# Altium project PROTO_QTOUCH.PrjPcb
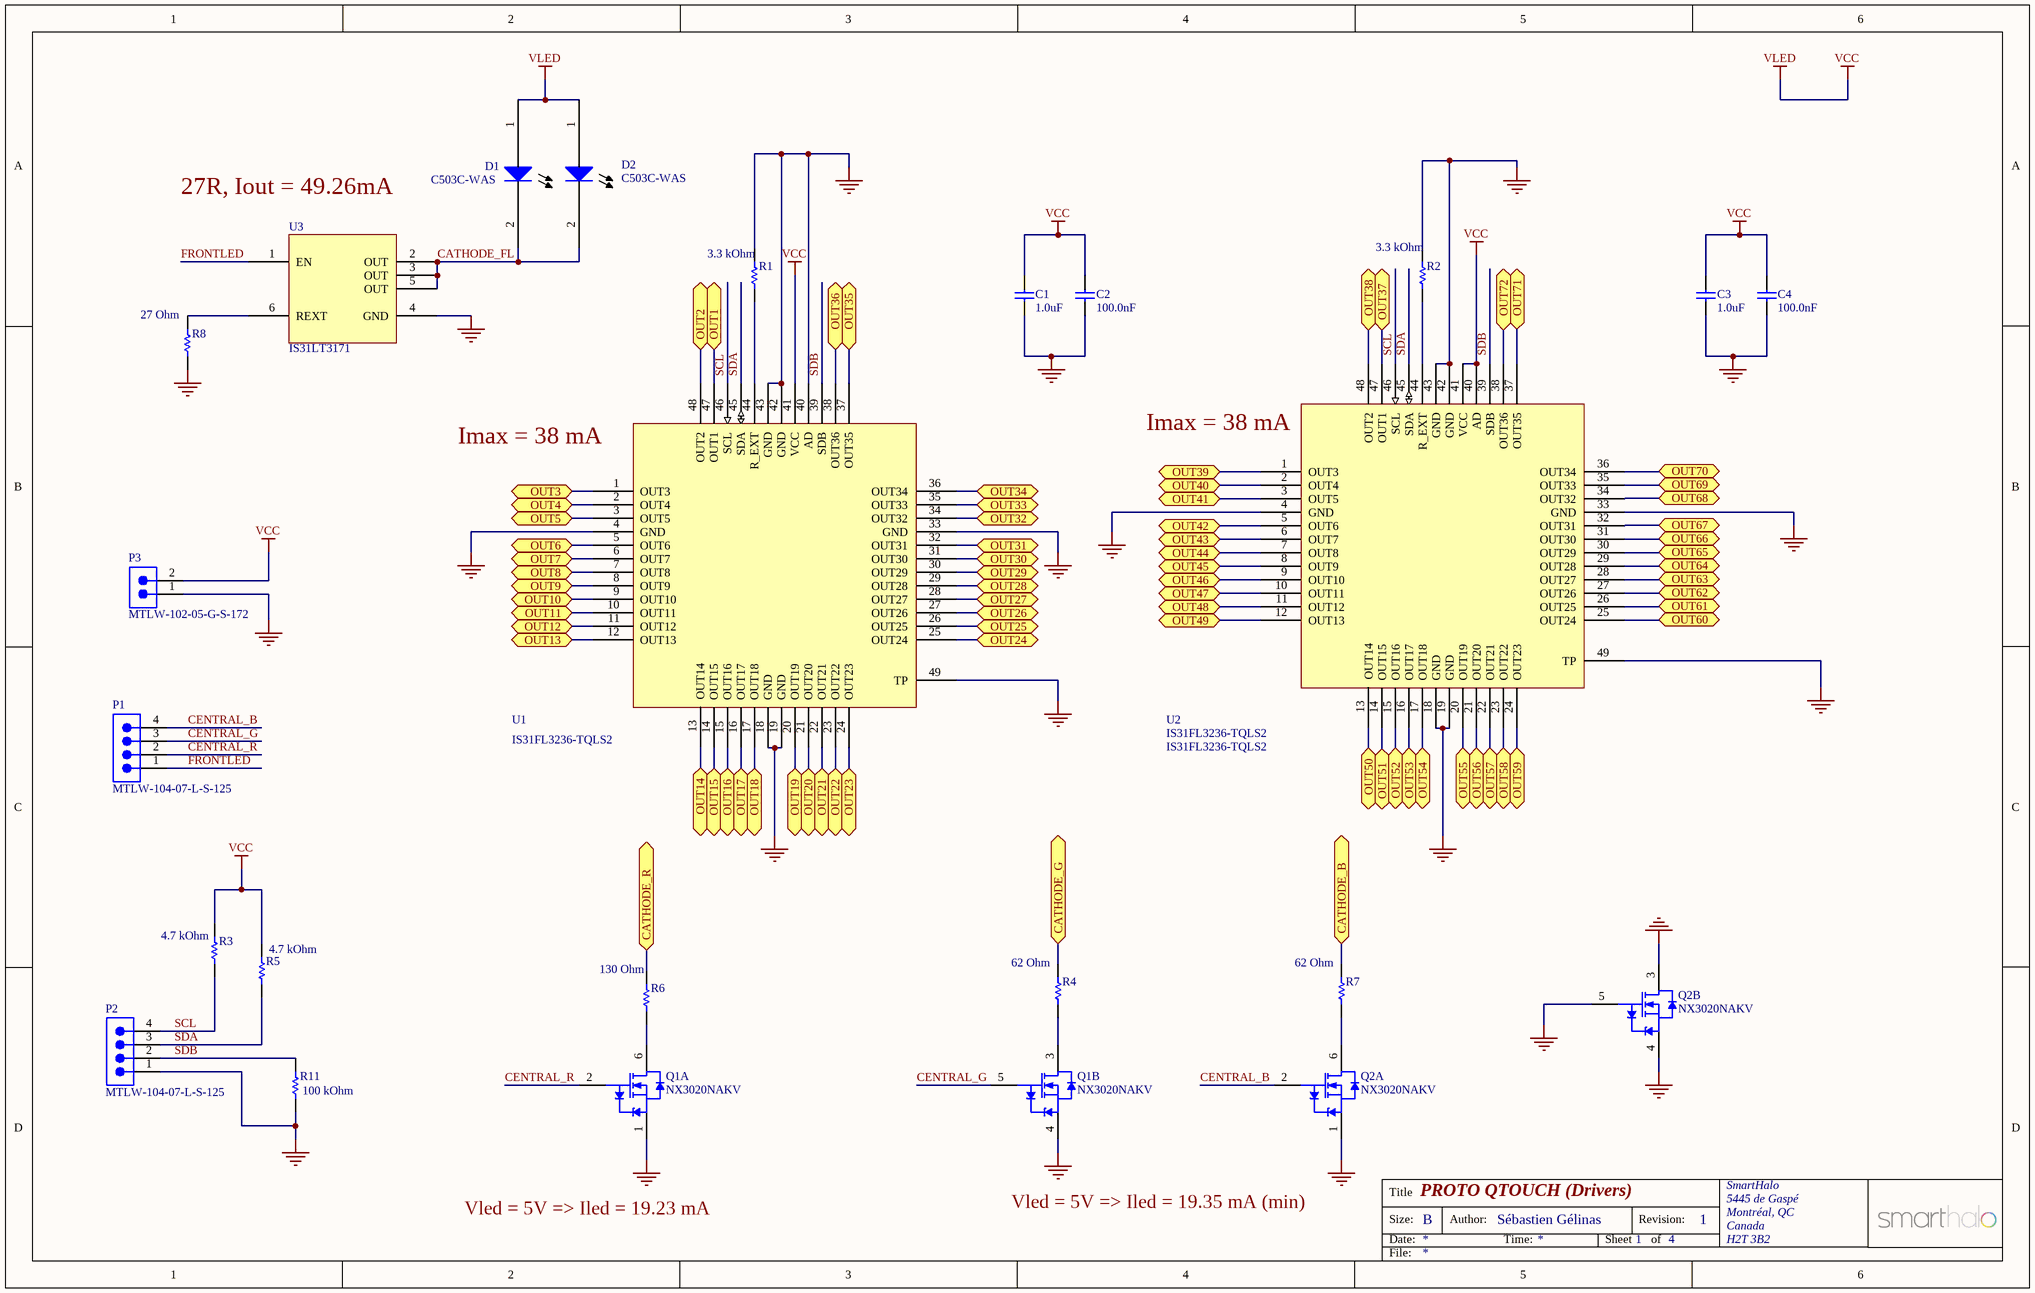
[diagram p0: DRIVERS_CONNECTORS.SchDoc]
4 sheets, 61 parts. Net scope: flat (ports and power ports of the same name join across sheets).
Board file: PROTO_QTOUCH.PcbDoc
Sheets:
  DRIVERS_CONNECTORS.SchDoc
  LEDS.SchDoc
  CENTRALLEDS.SchDoc
  TOUCH.SchDoc

## Sheet DRIVERS_CONNECTORS.SchDoc: PROTO QTOUCH (Drivers)
size B; Author: Sébastien Gélinas; Organization: SmartHalo; Address1: 5445 de Gaspé; Address2: Montréal, QC; Address3: Canada; Address4: H2T 3B2; Revision: 1; SheetNumber: 1; SheetTotal: 4

### Parts
C1  1.0uF  [CAPC0603(1608)100_N]
C2  100.0nF  [CAPC0603(1608)100_N]
C3  1.0uF  [CAPC0603(1608)100_N]
C4  100.0nF  [CAPC0603(1608)100_N]
D1  C503C-WAS  [FRONTLED_PADS]
D2  C503C-WAS  [FRONTLED_PADS]
P1  MTLW-104-07-L-S-125  [SMTC-MTLW-104-07-X-S-125]  (no BOM)
P2  MTLW-104-07-L-S-125  [SMTC-MTLW-104-07-X-S-125]  (no BOM)
P3  MTLW-102-05-G-S-172  [SMTC-MTLW-102-05-X-S-172]  (no BOM)
Q1  NX3020NAKV  [SOT666]  (parts A,B of 2)
Q2  NX3020NAKV  [SOT666]  (parts A,B of 2)
R1  3.3 kOhm  [RESC0603(1608)_M]
R2  3.3 kOhm  [RESC0603(1608)_M]
R3  4.7 kOhm  [RESC0603(1608)_M]
R4  62 Ohm  [RESC0603(1608)_M]
R5  4.7 kOhm  [RESC0603(1608)_M]
R6  130 Ohm  [RESC0603(1608)_M]
R7  62 Ohm  [RESC0603(1608)_M]
R8  27 Ohm  [RESC0603(1608)_M]
R11  100 kOhm  [RESC0603(1608)_M]
U1  IS31FL3236-TQLS2  [TQFP48]
U2  IS31FL3236-TQLS2  [TQFP48]
U3  IS31LT3171  [SOT23-6]

### Ports
CATHODE_B, CATHODE_G, CATHODE_R, OUT1, OUT2, OUT3, OUT4, OUT5, OUT6, OUT7, OUT8, OUT9, OUT10, OUT11, OUT12, OUT13, OUT14, OUT15, OUT16, OUT17, OUT18, OUT19, OUT20, OUT21, OUT22, OUT23, OUT24, OUT25, OUT26, OUT27, OUT28, OUT29, OUT30, OUT31, OUT32, OUT33, OUT34, OUT35, OUT36, OUT37, OUT38, OUT39, OUT40, OUT41, OUT42, OUT43, OUT44, OUT45, OUT46, OUT47, OUT48, OUT49, OUT50, OUT51, OUT52, OUT53, OUT54, OUT55, OUT56, OUT57, OUT58, OUT59, OUT60, OUT61, OUT62, OUT63, OUT64, OUT65, OUT66, OUT67, OUT68, OUT69, OUT70, OUT71, OUT72

### Nets
GND: C1.2 C2.2 C3.2 C4.2 P2.1 P3.1 Q1.1(S1) Q1.4(S2) Q2.1(S1) Q2.3(D2) Q2.4(S2) Q2.5(G2) R1.2 R2.2 R8.1 R11.1 U1.4(GND) U1.18(GND) U1.19(GND) U1.33(GND) U1.40(AD) U1.42(GND) U1.43(GND) U1.49(TP) U2.4(GND) U2.18(GND) U2.19(GND) U2.33(GND) U2.42(GND) U2.43(GND) U2.49(TP) U3.4(GND)
VCC: C1.1 C2.1 C3.1 C4.1 D1.1(Anode) D2.1(Anode) P3.2 R3.2 R5.2 U1.41(VCC) U2.40(AD) U2.41(VCC)  [also labelled VLED]
CATHODE_FL: D1.2(Cathode) D2.2(Cathode) U3.2(OUT) U3.3(OUT) U3.5(OUT)
CENTRAL_B: P1.4 Q2.2(G1)
CENTRAL_G: P1.3 Q1.5(G2)
CENTRAL_R: P1.2 Q1.2(G1)
FRONTLED: P1.1 U3.1(EN)
SCL: P2.4 R3.1 U1.46(SCL) U2.46(SCL)
SDA: P2.3 R5.1 U1.45(SDA) U2.45(SDA)
SDB: P2.2 R11.2 U1.39(SDB) U2.39(SDB)
NetLED1_2: R6.2 ; port CATHODE_R
NetLED1_3: R4.2 ; port CATHODE_G
NetLED1_4: R7.2 ; port CATHODE_B
NetLED2_2: U1.20(OUT19) ; port OUT19
NetLED2_3: U1.21(OUT20) ; port OUT20
NetLED2_4: U1.22(OUT21) ; port OUT21
NetLED3_2: U1.15(OUT16) ; port OUT16
NetLED3_3: U1.16(OUT17) ; port OUT17
NetLED3_4: U1.17(OUT18) ; port OUT18
NetLED4_2: U1.12(OUT13) ; port OUT13
NetLED4_3: U1.13(OUT14) ; port OUT14
NetLED4_4: U1.14(OUT15) ; port OUT15
NetLED5_2: U1.9(OUT10) ; port OUT10
NetLED5_3: U1.10(OUT11) ; port OUT11
NetLED5_4: U1.11(OUT12) ; port OUT12
NetLED6_2: U1.6(OUT7) ; port OUT7
NetLED6_3: U1.7(OUT8) ; port OUT8
NetLED6_4: U1.8(OUT9) ; port OUT9
NetLED7_2: U1.2(OUT4) ; port OUT4
NetLED7_3: U1.3(OUT5) ; port OUT5
NetLED7_4: U1.5(OUT6) ; port OUT6
NetLED8_2: U1.47(OUT1) ; port OUT1
NetLED8_3: U1.48(OUT2) ; port OUT2
NetLED8_4: U1.1(OUT3) ; port OUT3
NetLED9_2: U2.36(OUT34) ; port OUT70
NetLED9_3: U2.37(OUT35) ; port OUT71
NetLED9_4: U2.38(OUT36) ; port OUT72
NetLED10_2: U2.32(OUT31) ; port OUT67
NetLED10_3: U2.34(OUT32) ; port OUT68
NetLED10_4: U2.35(OUT33) ; port OUT69
NetLED11_2: U2.29(OUT28) ; port OUT64
NetLED11_3: U2.30(OUT29) ; port OUT65
NetLED11_4: U2.31(OUT30) ; port OUT66
NetLED12_2: U2.26(OUT25) ; port OUT61
NetLED12_3: U2.27(OUT26) ; port OUT62
NetLED12_4: U2.28(OUT27) ; port OUT63
NetLED13_2: U2.23(OUT22) ; port OUT58
NetLED13_3: U2.24(OUT23) ; port OUT59
NetLED13_4: U2.25(OUT24) ; port OUT60
NetLED14_2: U2.20(OUT19) ; port OUT55
NetLED14_3: U2.21(OUT20) ; port OUT56
NetLED14_4: U2.22(OUT21) ; port OUT57
NetLED15_2: U2.15(OUT16) ; port OUT52
NetLED15_3: U2.16(OUT17) ; port OUT53
NetLED15_4: U2.17(OUT18) ; port OUT54
NetLED16_2: U2.12(OUT13) ; port OUT49
NetLED16_3: U2.13(OUT14) ; port OUT50
NetLED16_4: U2.14(OUT15) ; port OUT51
NetLED17_2: U2.9(OUT10) ; port OUT46
NetLED17_3: U2.10(OUT11) ; port OUT47
NetLED17_4: U2.11(OUT12) ; port OUT48
NetLED18_2: U2.6(OUT7) ; port OUT43
NetLED18_3: U2.7(OUT8) ; port OUT44
NetLED18_4: U2.8(OUT9) ; port OUT45
NetLED19_2: U2.2(OUT4) ; port OUT40
NetLED19_3: U2.3(OUT5) ; port OUT41
NetLED19_4: U2.5(OUT6) ; port OUT42
NetLED20_2: U2.47(OUT1) ; port OUT37
NetLED20_3: U2.48(OUT2) ; port OUT38
NetLED20_4: U2.1(OUT3) ; port OUT39
NetLED21_2: U1.36(OUT34) ; port OUT34
NetLED21_3: U1.37(OUT35) ; port OUT35
NetLED21_4: U1.38(OUT36) ; port OUT36
NetLED22_2: U1.32(OUT31) ; port OUT31
NetLED22_3: U1.34(OUT32) ; port OUT32
NetLED22_4: U1.35(OUT33) ; port OUT33
NetLED23_2: U1.29(OUT28) ; port OUT28
NetLED23_3: U1.30(OUT29) ; port OUT29
NetLED23_4: U1.31(OUT30) ; port OUT30
NetLED24_2: U1.26(OUT25) ; port OUT25
NetLED24_3: U1.27(OUT26) ; port OUT26
NetLED24_4: U1.28(OUT27) ; port OUT27
NetLED25_2: U1.23(OUT22) ; port OUT22
NetLED25_3: U1.24(OUT23) ; port OUT23
NetLED25_4: U1.25(OUT24) ; port OUT24
NetQ1_3: Q1.3(D2) R4.1
NetQ1_6: Q1.6(D1) R6.1
NetQ2_6: Q2.6(D1) R7.1
NetR1_1: R1.1 U1.44(R_EXT)
NetR2_1: R2.1 U2.44(R_EXT)
NetR8_2: R8.2 U3.6(REXT)

### Notes on the sheet
- 27R, Iout = 49.26mA
- (near U2) Imax = 38 mA
- (near U1) Imax = 38 mA
- Vled = 5V => Iled = 19.23 mA
- Vled = 5V => Iled = 19.35 mA (min)
- Title
- Size:
- Date:
- B
- Author:
- Time:
- Sheet
- Revision:
- of
- File:

### Library data of the parts
C1-C4 = CAP0603: Chip Cap 0603 X7R 10%; Part Number: C0402-1n0; Note: Chip Cap X7R 10%; Artikkelnr Noca: 20039223; Published: 2009-05-08; LatestRevisionDate: 2009-11-23; Publisher: Nordic Semiconductor; Manufacturer: *; Manufacturer Part Number: *; Datasheet: *; Footprint: 0603; Pin Count: 2; Supplier: *
  C1 C3: Value: 1.0uF
  C2 C4: Value: 100.0nF
D1 D2 = C503C-WAS: Cree 5mm Round LED C503C-WAS; pin to pad: A>1 C>2
P1 P2 = SMTC-MTLW-104-07-X-S-125: Low Profile .025" SQ Post Header, Through-hole, Vertical, -55 to 125 degC, 2.54 mm Pitch, 4-Pin, Male, RoHS; Manufacturer: Samtec; Pitch: 2.54 mm; PackageDescription: Low Profile Terminal Assembly; PartNumber: MTLW-104-07-L-S-125; PackageReference: MTLW-104-07-X-S-125; ComponentLink1Description: Manufacturer URL; ComponentLink2Description: Datasheet; ComponentLink2URL: http://www.samtec.com/documents/webfiles/pdf/MTLW_TH.PDF; ComponentLink3Description: Package Specification; Mounting Technology: Through-hole; ComponentLink3URL: http://www.samtec.com/documents/webfiles/cpdf/MTLW-1XX-XX-XX-X-XXX-XX-XX-MKT1.pdf; ComponentLink1URL: http://www.samtec.com; Orientation: Vertical; PackageVersion: T, 6/1991; DatasheetVersion: F-214; Temperature Range: -55 to 125 degC; RoHS: True
P3 = SMTC-MTLW-102-05-X-S-172: Low Profile .025" SQ Post Header, Through-hole, Vertical, -55 to 125 degC, 2.54 mm Pitch, 2-Pin, Male, RoHS; Manufacturer: Samtec; Pitch: 2.54 mm; ComponentLink2URL: http://www.samtec.com/documents/webfiles/pdf/MTLW_TH.PDF; PackageDescription: Low Profile Terminal Assembly; ComponentLink3URL: http://www.samtec.com/documents/webfiles/cpdf/MTLW-1XX-XX-XX-X-XXX-XX-XX-MKT1.pdf; PackageReference: MTLW-102-05-X-S-172; Mounting Technology: Through-hole; ComponentLink2Description: Datasheet; PackageVersion: T, 6/1991; Orientation: Vertical; DatasheetVersion: F-214; RoHS: True; ComponentLink3Description: Package Specification; ComponentLink1URL: http://www.samtec.com; Temperature Range: -55 to 125 degC; PartNumber: MTLW-102-05-G-S-172; ComponentLink1Description: Manufacturer URL
Q1 Q2 = NX3020NAKV: 30 V, 200 mA dual N-channel Trench MOSFET; Manufacturer: NXP Semiconductors
R1 R2 = CMP-1012-00090-1: 3K3 0.1W 5% 0603 (1608 Metric)  SMD; Case-Metric: 1608; Case-EIA: 0603; Tolerance: 5 %; Technology: SMT; Power: 0.1 W; Value: 3.3 kOhm
R3 R5 = CMP-1012-00090-1: 4K7 0.1W 5% 0603 (1608 Metric)  SMD; Case-Metric: 1608; Case-EIA: 0603; Tolerance: 5 %; Technology: SMT; Power: 0.1 W; Value: 4.7 kOhm
R4 R7 = CMP-1012-00090-1: 62R 0.1W 5% 0603 (1608 Metric)  SMD; Case-Metric: 1608; Case-EIA: 0603; Tolerance: 5 %; Technology: SMT; Power: 0.1 W; Value: 62 Ohm
R6 = CMP-1012-00090-1: 130R 0.1W 5% 0603 (1608 Metric)  SMD; Case-Metric: 1608; Case-EIA: 0603; Tolerance: 5 %; Technology: SMT; Power: 0.1 W; Value: 130 Ohm
R8 = CMP-1012-00090-1: 27R 0.1W 5% 0603 (1608 Metric)  SMD; Case-Metric: 1608; Case-EIA: 0603; Tolerance: 5 %; Technology: SMT; Power: 0.1 W; Value: 27 Ohm
R11 = CMP-1012-00090-1: 100k 0.1W 5% 0603 (1608 Metric)  SMD; Case-Metric: 1608; Case-EIA: 0603; Tolerance: 5 %; Technology: SMT; Power: 0.1 W; Value: 100 kOhm
U1 U2 = IS31FL3236-TQLS2: IC 36 CHANNELS LED DRIVER; Manufacturer: ISSI; Manufacturer Part Number: IS31FL3236-TQLS2
U3 = IS31LT3171: 10-TO-150MA CONSTANT-CURRENT LED DRIVER

## Sheet LEDS.SchDoc: LEDBO - LTSN-N213EGBW (LEDS)
size B; Author: Sébastien Gélinas; Organization: SmartHalo; Address1: 5445 de Gaspé; Address2: Montréal, QC; Address3: Canada; Address4: H2T 3B2; Revision: 1; SheetNumber: 4; SheetTotal: 4
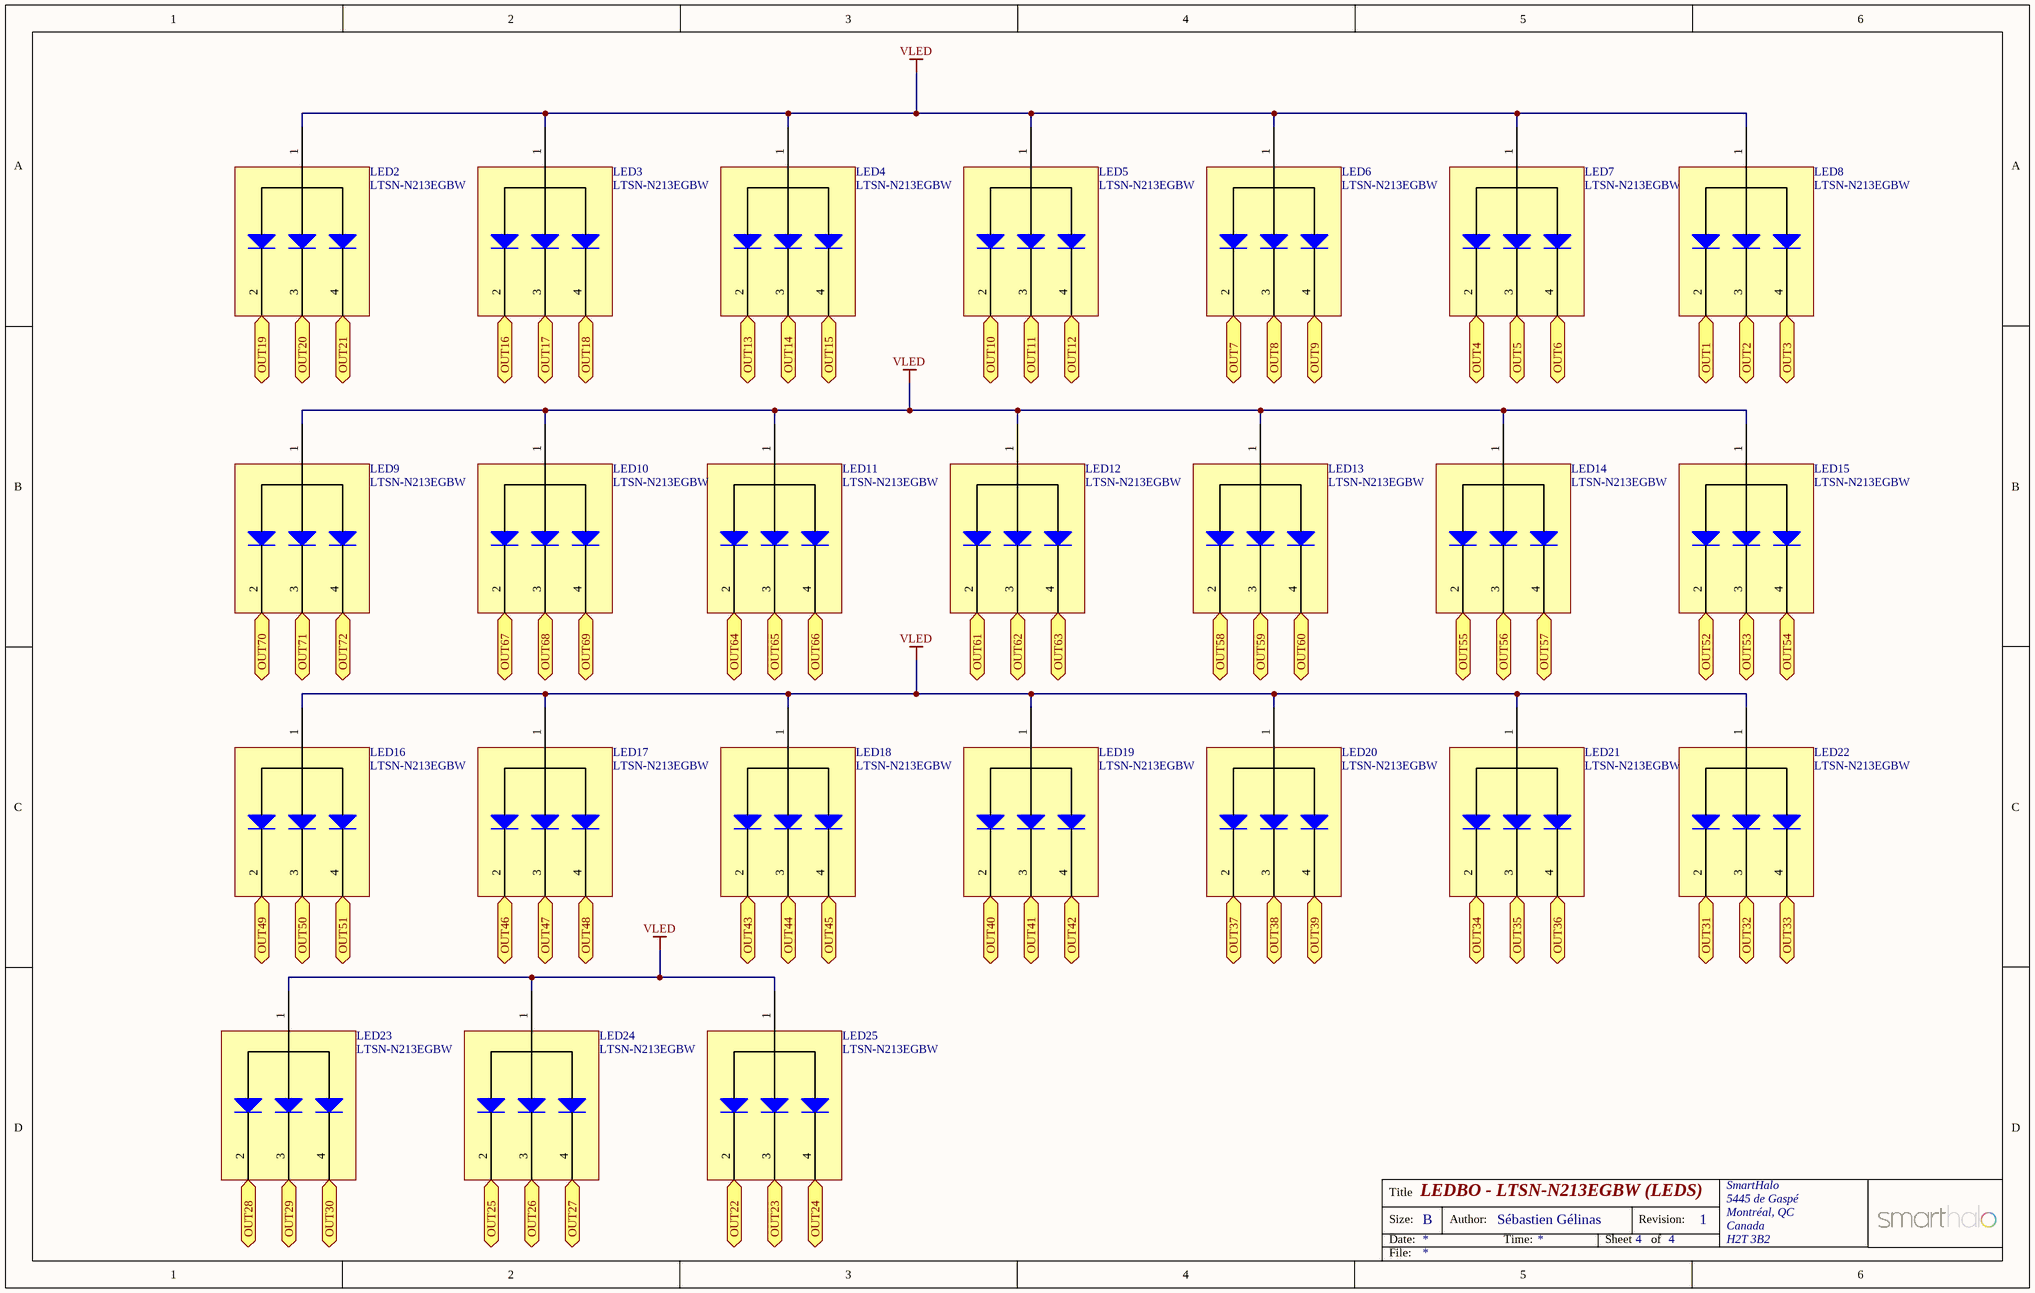
[diagram p1: LEDS.SchDoc]

### Parts
LED2  LTSN-N213EGBW  [LTSN-N213EGBW]
LED3  LTSN-N213EGBW  [LTSN-N213EGBW]
LED4  LTSN-N213EGBW  [LTSN-N213EGBW]
LED5  LTSN-N213EGBW  [LTSN-N213EGBW]
LED6  LTSN-N213EGBW  [LTSN-N213EGBW]
LED7  LTSN-N213EGBW  [LTSN-N213EGBW]
LED8  LTSN-N213EGBW  [LTSN-N213EGBW]
LED9  LTSN-N213EGBW  [LTSN-N213EGBW]
LED10  LTSN-N213EGBW  [LTSN-N213EGBW]
LED11  LTSN-N213EGBW  [LTSN-N213EGBW]
LED12  LTSN-N213EGBW  [LTSN-N213EGBW]
LED13  LTSN-N213EGBW  [LTSN-N213EGBW]
LED14  LTSN-N213EGBW  [LTSN-N213EGBW]
LED15  LTSN-N213EGBW  [LTSN-N213EGBW]
LED16  LTSN-N213EGBW  [LTSN-N213EGBW]
LED17  LTSN-N213EGBW  [LTSN-N213EGBW]
LED18  LTSN-N213EGBW  [LTSN-N213EGBW]
LED19  LTSN-N213EGBW  [LTSN-N213EGBW]
LED20  LTSN-N213EGBW  [LTSN-N213EGBW]
LED21  LTSN-N213EGBW  [LTSN-N213EGBW]
LED22  LTSN-N213EGBW  [LTSN-N213EGBW]
LED23  LTSN-N213EGBW  [LTSN-N213EGBW]
LED24  LTSN-N213EGBW  [LTSN-N213EGBW]
LED25  LTSN-N213EGBW  [LTSN-N213EGBW]

### Ports
OUT1, OUT2, OUT3, OUT4, OUT5, OUT6, OUT7, OUT8, OUT9, OUT10, OUT11, OUT12, OUT13, OUT14, OUT15, OUT16, OUT17, OUT18, OUT19, OUT20, OUT21, OUT22, OUT23, OUT24, OUT25, OUT26, OUT27, OUT28, OUT29, OUT30, OUT31, OUT32, OUT33, OUT34, OUT35, OUT36, OUT37, OUT38, OUT39, OUT40, OUT41, OUT42, OUT43, OUT44, OUT45, OUT46, OUT47, OUT48, OUT49, OUT50, OUT51, OUT52, OUT53, OUT54, OUT55, OUT56, OUT57, OUT58, OUT59, OUT60, OUT61, OUT62, OUT63, OUT64, OUT65, OUT66, OUT67, OUT68, OUT69, OUT70, OUT71, OUT72

### Nets
VLED: LED2.1(Anode) LED3.1(Anode) LED4.1(Anode) LED5.1(Anode) LED6.1(Anode) LED7.1(Anode) LED8.1(Anode) LED9.1(Anode) LED10.1(Anode) LED11.1(Anode) LED12.1(Anode) LED13.1(Anode) LED14.1(Anode) LED15.1(Anode) LED16.1(Anode) LED17.1(Anode) LED18.1(Anode) LED19.1(Anode) LED20.1(Anode) LED21.1(Anode) LED22.1(Anode) LED23.1(Anode) LED24.1(Anode) LED25.1(Anode)  [project net VCC]
NetLED2_2: LED2.2(Cathode_Red) ; port OUT19
NetLED2_3: LED2.3(Cathode_Green) ; port OUT20
NetLED2_4: LED2.4(Cathode_Blue) ; port OUT21
NetLED3_2: LED3.2(Cathode_Red) ; port OUT16
NetLED3_3: LED3.3(Cathode_Green) ; port OUT17
NetLED3_4: LED3.4(Cathode_Blue) ; port OUT18
NetLED4_2: LED4.2(Cathode_Red) ; port OUT13
NetLED4_3: LED4.3(Cathode_Green) ; port OUT14
NetLED4_4: LED4.4(Cathode_Blue) ; port OUT15
NetLED5_2: LED5.2(Cathode_Red) ; port OUT10
NetLED5_3: LED5.3(Cathode_Green) ; port OUT11
NetLED5_4: LED5.4(Cathode_Blue) ; port OUT12
NetLED6_2: LED6.2(Cathode_Red) ; port OUT7
NetLED6_3: LED6.3(Cathode_Green) ; port OUT8
NetLED6_4: LED6.4(Cathode_Blue) ; port OUT9
NetLED7_2: LED7.2(Cathode_Red) ; port OUT4
NetLED7_3: LED7.3(Cathode_Green) ; port OUT5
NetLED7_4: LED7.4(Cathode_Blue) ; port OUT6
NetLED8_2: LED8.2(Cathode_Red) ; port OUT1
NetLED8_3: LED8.3(Cathode_Green) ; port OUT2
NetLED8_4: LED8.4(Cathode_Blue) ; port OUT3
NetLED9_2: LED9.2(Cathode_Red) ; port OUT70
NetLED9_3: LED9.3(Cathode_Green) ; port OUT71
NetLED9_4: LED9.4(Cathode_Blue) ; port OUT72
NetLED10_2: LED10.2(Cathode_Red) ; port OUT67
NetLED10_3: LED10.3(Cathode_Green) ; port OUT68
NetLED10_4: LED10.4(Cathode_Blue) ; port OUT69
NetLED11_2: LED11.2(Cathode_Red) ; port OUT64
NetLED11_3: LED11.3(Cathode_Green) ; port OUT65
NetLED11_4: LED11.4(Cathode_Blue) ; port OUT66
NetLED12_2: LED12.2(Cathode_Red) ; port OUT61
NetLED12_3: LED12.3(Cathode_Green) ; port OUT62
NetLED12_4: LED12.4(Cathode_Blue) ; port OUT63
NetLED13_2: LED13.2(Cathode_Red) ; port OUT58
NetLED13_3: LED13.3(Cathode_Green) ; port OUT59
NetLED13_4: LED13.4(Cathode_Blue) ; port OUT60
NetLED14_2: LED14.2(Cathode_Red) ; port OUT55
NetLED14_3: LED14.3(Cathode_Green) ; port OUT56
NetLED14_4: LED14.4(Cathode_Blue) ; port OUT57
NetLED15_2: LED15.2(Cathode_Red) ; port OUT52
NetLED15_3: LED15.3(Cathode_Green) ; port OUT53
NetLED15_4: LED15.4(Cathode_Blue) ; port OUT54
NetLED16_2: LED16.2(Cathode_Red) ; port OUT49
NetLED16_3: LED16.3(Cathode_Green) ; port OUT50
NetLED16_4: LED16.4(Cathode_Blue) ; port OUT51
NetLED17_2: LED17.2(Cathode_Red) ; port OUT46
NetLED17_3: LED17.3(Cathode_Green) ; port OUT47
NetLED17_4: LED17.4(Cathode_Blue) ; port OUT48
NetLED18_2: LED18.2(Cathode_Red) ; port OUT43
NetLED18_3: LED18.3(Cathode_Green) ; port OUT44
NetLED18_4: LED18.4(Cathode_Blue) ; port OUT45
NetLED19_2: LED19.2(Cathode_Red) ; port OUT40
NetLED19_3: LED19.3(Cathode_Green) ; port OUT41
NetLED19_4: LED19.4(Cathode_Blue) ; port OUT42
NetLED20_2: LED20.2(Cathode_Red) ; port OUT37
NetLED20_3: LED20.3(Cathode_Green) ; port OUT38
NetLED20_4: LED20.4(Cathode_Blue) ; port OUT39
NetLED21_2: LED21.2(Cathode_Red) ; port OUT34
NetLED21_3: LED21.3(Cathode_Green) ; port OUT35
NetLED21_4: LED21.4(Cathode_Blue) ; port OUT36
NetLED22_2: LED22.2(Cathode_Red) ; port OUT31
NetLED22_3: LED22.3(Cathode_Green) ; port OUT32
NetLED22_4: LED22.4(Cathode_Blue) ; port OUT33
NetLED23_2: LED23.2(Cathode_Red) ; port OUT28
NetLED23_3: LED23.3(Cathode_Green) ; port OUT29
NetLED23_4: LED23.4(Cathode_Blue) ; port OUT30
NetLED24_2: LED24.2(Cathode_Red) ; port OUT25
NetLED24_3: LED24.3(Cathode_Green) ; port OUT26
NetLED24_4: LED24.4(Cathode_Blue) ; port OUT27
NetLED25_2: LED25.2(Cathode_Red) ; port OUT22
NetLED25_3: LED25.3(Cathode_Green) ; port OUT23
NetLED25_4: LED25.4(Cathode_Blue) ; port OUT24

### Notes on the sheet
- Title
- Size:
- Date:
- B
- Author:
- Time:
- Sheet
- Revision:
- of
- File:

### Library data of the parts
LED2-LED25 = LTSN-N213EGBW: LED SMD LTSN-N213EGBW; Manufacturer: LiteOn

## Sheet CENTRALLEDS.SchDoc: PROTO QTOUCH (Central LED)
size B; Author: Sébastien Gélinas; Organization: SmartHalo; Address1: 5445 de Gaspé; Address2: Montréal, QC; Address3: Canada; Address4: H2T 3B2; Revision: 1; SheetNumber: 3; SheetTotal: 4
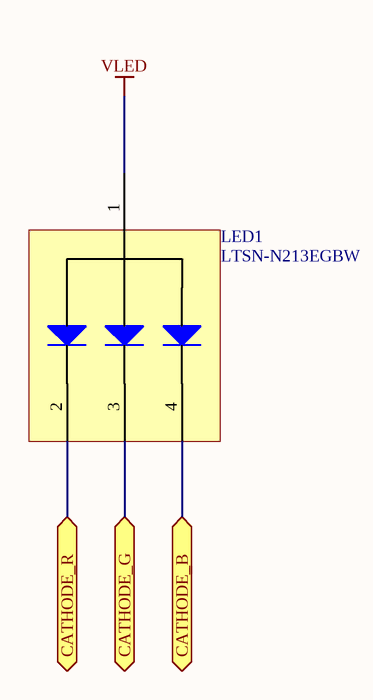
[diagram p2: CENTRALLEDS.SchDoc]

### Parts
LED1  LTSN-N213EGBW  [LTSN-N213EGBW]

### Ports
CATHODE_B, CATHODE_G, CATHODE_R

### Nets
VLED: LED1.1(Anode)  [project net VCC]
NetLED1_2: LED1.2(Cathode_Red) ; port CATHODE_R
NetLED1_3: LED1.3(Cathode_Green) ; port CATHODE_G
NetLED1_4: LED1.4(Cathode_Blue) ; port CATHODE_B

### Notes on the sheet
- Title
- Size:
- Date:
- B
- Author:
- Time:
- Sheet
- Revision:
- of
- File:

### Library data of the parts
LED1 = LTSN-N213EGBW: as LED2 on sheet LEDS

## Sheet TOUCH.SchDoc: PROTO QTOUCH (TOUCH)
size B; Author: Sébastien Gélinas; Organization: SmartHalo; Address1: 5445 de Gaspé; Address2: Montréal, QC; Address3: Canada; Address4: H2T 3B2; Revision: 1; SheetNumber: 2; SheetTotal: 4
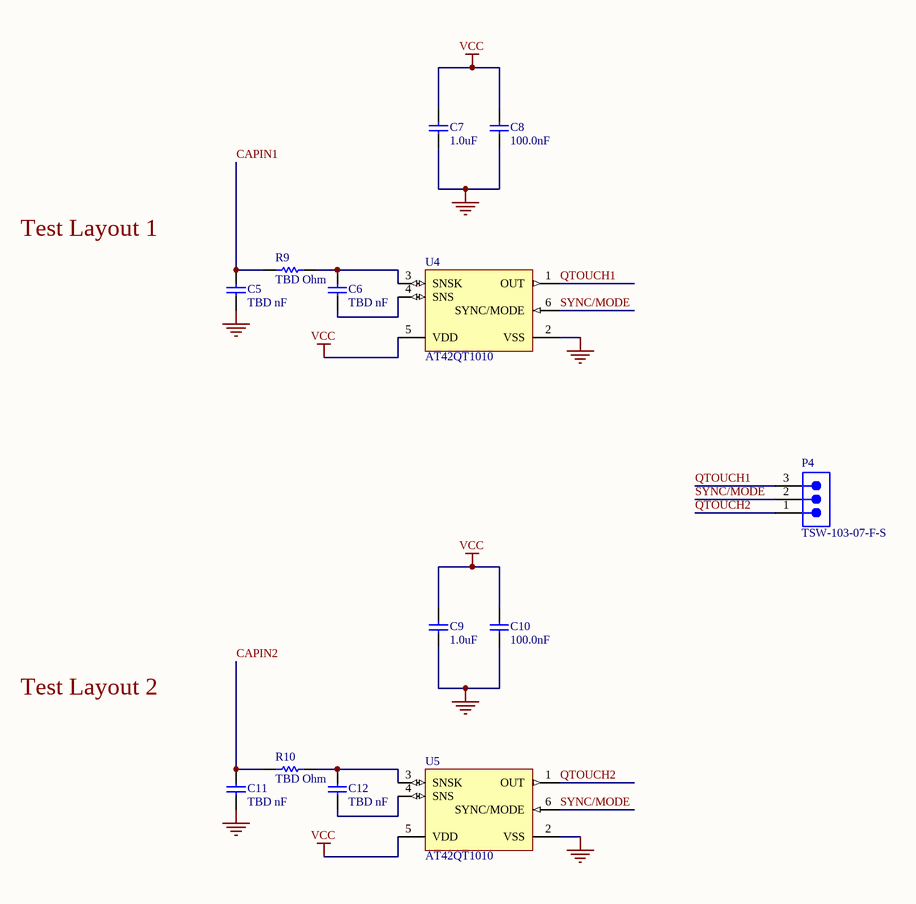
[diagram p3: TOUCH.SchDoc]

### Parts
C5  TBD nF  [CAPC0603(1608)100_N]
C6  TBD nF  [CAPC0603(1608)100_N]
C7  1.0uF  [CAPC0603(1608)100_N]
C8  100.0nF  [CAPC0603(1608)100_N]
C9  1.0uF  [CAPC0603(1608)100_N]
C10  100.0nF  [CAPC0603(1608)100_N]
C11  TBD nF  [CAPC0603(1608)100_N]
C12  TBD nF  [CAPC0603(1608)100_N]
P4  TSW-103-07-F-S  [SMTC-TSW-103-07-X-S]
R9  TBD Ohm  [RESC0603(1608)_M]
R10  TBD Ohm  [RESC0603(1608)_M]
U4  AT42QT1010  [6ST1_N]
U5  AT42QT1010  [6ST1_N]

### Nets
GND: C5.2 C7.2 C8.2 C9.2 C10.2 C11.2 U4.2(VSS) U5.2(VSS)
VCC: C7.1 C8.1 C9.1 C10.1 U4.5(VDD) U5.5(VDD)
CAPIN1: C5.1 R9.2
CAPIN2: C11.1 R10.2
QTOUCH1: P4.3 U4.1(OUT)
QTOUCH2: P4.1 U5.1(OUT)
SYNC/MODE: P4.2 U4.6(SYNC/MODE) U5.6(SYNC/MODE)
NetC6_1: C6.1 U4.4(SNS)
NetC6_2: C6.2 R9.1 U4.3(SNSK)
NetC12_1: C12.1 U5.4(SNS)
NetC12_2: C12.2 R10.1 U5.3(SNSK)

### Notes on the sheet
- Test Layout 1
- Test Layout 2
- Title
- Size:
- Date:
- B
- Author:
- Time:
- Sheet
- Revision:
- of
- File:

### Library data of the parts
C5 C7-C11 = CAP0603: as C1 on sheet DRIVERS_CONNECTORS; Published: 2009-05-08; LatestRevisionDate: 2009-11-23; Publisher: Nordic Semiconductor; Manufacturer: *; Manufacturer Part Number: *; Datasheet: *; Footprint: 0603; Pin Count: 2; Supplier: *
  C5 C11: Value: TBD nF
  C7 C9: Value: 1.0uF
  C8 C10: Value: 100.0nF
C6 C12 = CAP0603: Chip Cap 0603 C0G best or X7R or X5R 10%; Part Number: C0402-1n0; Note: Chip Cap C0G best or X7R or X5R TBD%; Artikkelnr Noca: 20039223; Published: 2009-05-08; LatestRevisionDate: 2009-11-23; Publisher: Nordic Semiconductor; Value: TBD nF; Manufacturer: *; Manufacturer Part Number: *; Datasheet: *; Footprint: 0603; Pin Count: 2; Supplier: *
P4 = CMP-1024-00331-1: 0.025" SQ Post Header, Through-hole, Vertical, -55 to 125 degC, 2.54 mm Pitch, 3-Pin, Male, RoHS; Manufacturer: Samtec; Pitch: 2.54 mm; DatasheetVersion: F-214; ComponentLink1Description: Manufacturer URL; ComponentLink3URL: http://www.samtec.com/documents/webfiles/cpdf/TSW-XXX-XX-XXX-X-XX-XXX-MKT.pdf; Mounting Technology: Through-hole; PackageDescription: .025[0.64] SQ. Post Terminal Strip Assembly; Temperature Range: -55 to 125 degC; ComponentLink3Description: Package Specification; Orientation: Vertical; PartNumber: TSW-103-07-F-S; RoHS: True; PackageVersion: DM, 8/1988; ComponentLink2Description: Datasheet; ComponentLink1URL: http://www.samtec.com; ComponentLink2URL: http://www.samtec.com/documents/webfiles/pdf/TSW_TH.PDF; PackageReference: TSW-103-07-X-S
R9 R10 = CMP-1012-00090-1: TBDR TBDW 10% <200ppm/C 0603 (1608 Metric)  SMD; Case-Metric: 1608; Case-EIA: 0603; Tolerance: 10 %; Technology: SMT; Power: TBD W; Value: TBD Ohm
U4 U5 = AT42QT1010: Single-key QTouch® Touch Sensor IC; Manufacturer: Atmel

## Nets that join several sheets
GND: DRIVERS_CONNECTORS (32 pins), TOUCH (8 pins)
VCC: DRIVERS_CONNECTORS (12 pins), LEDS (24 pins), CENTRALLEDS (LED1.1), TOUCH (6 pins)
NetLED1_2: DRIVERS_CONNECTORS (R6.2), CENTRALLEDS (LED1.2)
NetLED1_3: DRIVERS_CONNECTORS (R4.2), CENTRALLEDS (LED1.3)
NetLED1_4: DRIVERS_CONNECTORS (R7.2), CENTRALLEDS (LED1.4)
NetLED2_2: DRIVERS_CONNECTORS (U1.20), LEDS (LED2.2)
NetLED2_3: DRIVERS_CONNECTORS (U1.21), LEDS (LED2.3)
NetLED2_4: DRIVERS_CONNECTORS (U1.22), LEDS (LED2.4)
NetLED3_2: DRIVERS_CONNECTORS (U1.15), LEDS (LED3.2)
NetLED3_3: DRIVERS_CONNECTORS (U1.16), LEDS (LED3.3)
NetLED3_4: DRIVERS_CONNECTORS (U1.17), LEDS (LED3.4)
NetLED4_2: DRIVERS_CONNECTORS (U1.12), LEDS (LED4.2)
NetLED4_3: DRIVERS_CONNECTORS (U1.13), LEDS (LED4.3)
NetLED4_4: DRIVERS_CONNECTORS (U1.14), LEDS (LED4.4)
NetLED5_2: DRIVERS_CONNECTORS (U1.9), LEDS (LED5.2)
NetLED5_3: DRIVERS_CONNECTORS (U1.10), LEDS (LED5.3)
NetLED5_4: DRIVERS_CONNECTORS (U1.11), LEDS (LED5.4)
NetLED6_2: DRIVERS_CONNECTORS (U1.6), LEDS (LED6.2)
NetLED6_3: DRIVERS_CONNECTORS (U1.7), LEDS (LED6.3)
NetLED6_4: DRIVERS_CONNECTORS (U1.8), LEDS (LED6.4)
NetLED7_2: DRIVERS_CONNECTORS (U1.2), LEDS (LED7.2)
NetLED7_3: DRIVERS_CONNECTORS (U1.3), LEDS (LED7.3)
NetLED7_4: DRIVERS_CONNECTORS (U1.5), LEDS (LED7.4)
NetLED8_2: DRIVERS_CONNECTORS (U1.47), LEDS (LED8.2)
NetLED8_3: DRIVERS_CONNECTORS (U1.48), LEDS (LED8.3)
NetLED8_4: DRIVERS_CONNECTORS (U1.1), LEDS (LED8.4)
NetLED9_2: DRIVERS_CONNECTORS (U2.36), LEDS (LED9.2)
NetLED9_3: DRIVERS_CONNECTORS (U2.37), LEDS (LED9.3)
NetLED9_4: DRIVERS_CONNECTORS (U2.38), LEDS (LED9.4)
NetLED10_2: DRIVERS_CONNECTORS (U2.32), LEDS (LED10.2)
NetLED10_3: DRIVERS_CONNECTORS (U2.34), LEDS (LED10.3)
NetLED10_4: DRIVERS_CONNECTORS (U2.35), LEDS (LED10.4)
NetLED11_2: DRIVERS_CONNECTORS (U2.29), LEDS (LED11.2)
NetLED11_3: DRIVERS_CONNECTORS (U2.30), LEDS (LED11.3)
NetLED11_4: DRIVERS_CONNECTORS (U2.31), LEDS (LED11.4)
NetLED12_2: DRIVERS_CONNECTORS (U2.26), LEDS (LED12.2)
NetLED12_3: DRIVERS_CONNECTORS (U2.27), LEDS (LED12.3)
NetLED12_4: DRIVERS_CONNECTORS (U2.28), LEDS (LED12.4)
NetLED13_2: DRIVERS_CONNECTORS (U2.23), LEDS (LED13.2)
NetLED13_3: DRIVERS_CONNECTORS (U2.24), LEDS (LED13.3)
NetLED13_4: DRIVERS_CONNECTORS (U2.25), LEDS (LED13.4)
NetLED14_2: DRIVERS_CONNECTORS (U2.20), LEDS (LED14.2)
NetLED14_3: DRIVERS_CONNECTORS (U2.21), LEDS (LED14.3)
NetLED14_4: DRIVERS_CONNECTORS (U2.22), LEDS (LED14.4)
NetLED15_2: DRIVERS_CONNECTORS (U2.15), LEDS (LED15.2)
NetLED15_3: DRIVERS_CONNECTORS (U2.16), LEDS (LED15.3)
NetLED15_4: DRIVERS_CONNECTORS (U2.17), LEDS (LED15.4)
NetLED16_2: DRIVERS_CONNECTORS (U2.12), LEDS (LED16.2)
NetLED16_3: DRIVERS_CONNECTORS (U2.13), LEDS (LED16.3)
NetLED16_4: DRIVERS_CONNECTORS (U2.14), LEDS (LED16.4)
NetLED17_2: DRIVERS_CONNECTORS (U2.9), LEDS (LED17.2)
NetLED17_3: DRIVERS_CONNECTORS (U2.10), LEDS (LED17.3)
NetLED17_4: DRIVERS_CONNECTORS (U2.11), LEDS (LED17.4)
NetLED18_2: DRIVERS_CONNECTORS (U2.6), LEDS (LED18.2)
NetLED18_3: DRIVERS_CONNECTORS (U2.7), LEDS (LED18.3)
NetLED18_4: DRIVERS_CONNECTORS (U2.8), LEDS (LED18.4)
NetLED19_2: DRIVERS_CONNECTORS (U2.2), LEDS (LED19.2)
NetLED19_3: DRIVERS_CONNECTORS (U2.3), LEDS (LED19.3)
NetLED19_4: DRIVERS_CONNECTORS (U2.5), LEDS (LED19.4)
NetLED20_2: DRIVERS_CONNECTORS (U2.47), LEDS (LED20.2)
NetLED20_3: DRIVERS_CONNECTORS (U2.48), LEDS (LED20.3)
NetLED20_4: DRIVERS_CONNECTORS (U2.1), LEDS (LED20.4)
NetLED21_2: DRIVERS_CONNECTORS (U1.36), LEDS (LED21.2)
NetLED21_3: DRIVERS_CONNECTORS (U1.37), LEDS (LED21.3)
NetLED21_4: DRIVERS_CONNECTORS (U1.38), LEDS (LED21.4)
NetLED22_2: DRIVERS_CONNECTORS (U1.32), LEDS (LED22.2)
NetLED22_3: DRIVERS_CONNECTORS (U1.34), LEDS (LED22.3)
NetLED22_4: DRIVERS_CONNECTORS (U1.35), LEDS (LED22.4)
NetLED23_2: DRIVERS_CONNECTORS (U1.29), LEDS (LED23.2)
NetLED23_3: DRIVERS_CONNECTORS (U1.30), LEDS (LED23.3)
NetLED23_4: DRIVERS_CONNECTORS (U1.31), LEDS (LED23.4)
NetLED24_2: DRIVERS_CONNECTORS (U1.26), LEDS (LED24.2)
NetLED24_3: DRIVERS_CONNECTORS (U1.27), LEDS (LED24.3)
NetLED24_4: DRIVERS_CONNECTORS (U1.28), LEDS (LED24.4)
NetLED25_2: DRIVERS_CONNECTORS (U1.23), LEDS (LED25.2)
NetLED25_3: DRIVERS_CONNECTORS (U1.24), LEDS (LED25.3)
NetLED25_4: DRIVERS_CONNECTORS (U1.25), LEDS (LED25.4)